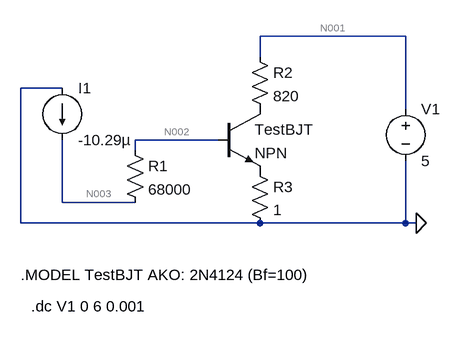
[diagram p0: schematic Draft2.asc]
Draft2.asc, the LTspice schematic file:
Version 4
SHEET 1 880 680
WIRE 512 -48 288 -48
WIRE 288 -16 288 -48
WIRE -16 32 -80 32
WIRE 512 64 512 -48
WIRE 224 112 96 112
WIRE 96 128 96 112
WIRE -16 208 -16 112
WIRE 96 208 -16 208
WIRE -80 240 -80 32
WIRE 288 240 -80 240
WIRE 512 240 512 144
WIRE 512 240 288 240
WIRE 528 240 512 240
FLAG 528 240 0
SYMBOL res 80 112 R0
SYMATTR InstName R1
SYMATTR Value 68000
SYMBOL res 272 -32 R0
SYMATTR InstName R2
SYMATTR Value 820
SYMBOL voltage 512 48 R0
WINDOW 123 0 0 Left 0
WINDOW 39 0 0 Left 0
SYMATTR InstName V1
SYMATTR Value 5
SYMBOL current -16 32 R0
WINDOW 123 0 0 Left 0
WINDOW 39 0 0 Left 0
SYMATTR InstName I1
SYMATTR Value -10.29µ
SYMBOL npn 224 64 R0
SYMATTR InstName TestBJT
SYMBOL res 272 144 R0
SYMATTR InstName R3
SYMATTR Value 1
TEXT -80 320 Left 2 !.MODEL TestBJT AKO: 2N4124 (Bf=100)
TEXT -64 368 Left 2 !.dc V1 0 6 0.001

The netlist it stands for:
* Draft2.asc
R1 N002 N003 68000
R2 N001 P001 820
V1 N001 0 5
I1 0 N003 -10.29µ
Q§TestBJT P001 N002 P002 0 NPN
R3 P002 0 1
.model NPN NPN
.model PNP PNP
.lib standard.bjt
.MODEL TestBJT AKO: 2N4124 (Bf=100)
.dc V1 0 6 0.001
.backanno
.end

* Results of the author's LTspice run, read from the files saved beside the schematic
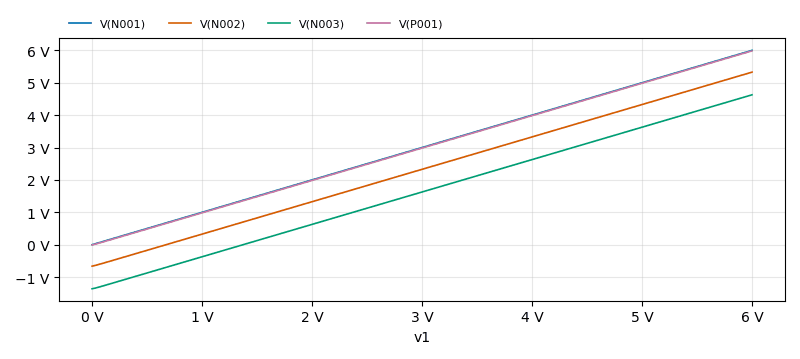
[diagram p1: DC transfer characteristic of Draft2.asc, plotted from the saved traces]
* DC transfer characteristic, 1 run:
*   V(N001): 0 V at v1=0 V, 6 V at v1=6 V, min 0 V, max 6 V
*   V(N002): -661.6 mV at v1=0 V, 5.327 V at v1=6 V, min -661.6 mV, max 5.327 V
*   V(N003): -1.361 V at v1=0 V, 4.628 V at v1=6 V, min -1.361 V, max 4.628 V
*   V(P001): -6.112 mV at v1=0 V, 5.983 V at v1=6 V, min -6.112 mV, max 5.983 V